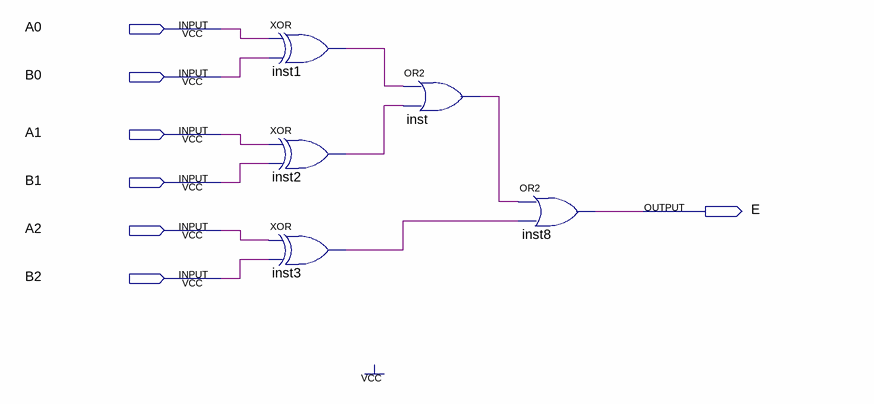
[diagram p0: schematic sheet]
// Quartus schematic v2_3.bdf as structural Verilog: 5 symbols, 7 pins
module v2_3 (
  input  A0,
  input  B0,
  input  A1,
  input  B1,
  input  A2,
  input  B2,
  output E
);

  wire inst1_out, inst2_out, inst3_out, inst_out;

  xor inst1 (inst1_out, A0, B0);
  xor inst2 (inst2_out, A1, B1);
  xor inst3 (inst3_out, A2, B2);
  or inst (inst_out, inst1_out, inst2_out);
  or inst8 (E, inst_out, inst3_out);
endmodule
